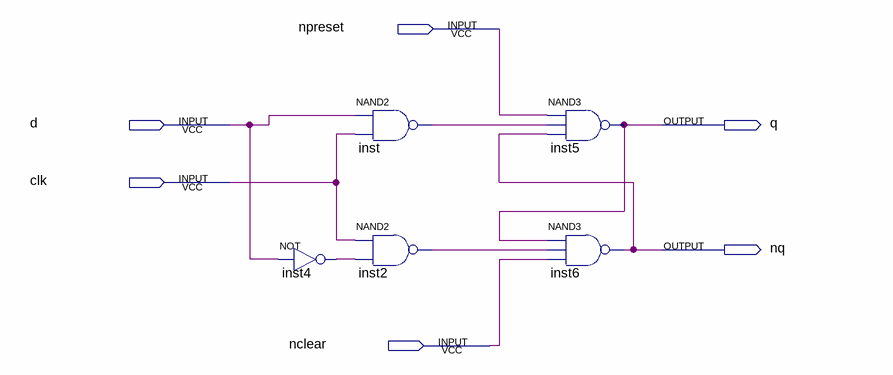
[diagram p0: schematic sheet]
// Quartus schematic latchd.bdf as structural Verilog: 5 symbols, 6 pins
module latchd (
  input  npreset,
  input  d,
  input  clk,
  input  nclear,
  output q,
  output nq
);

  wire inst2_out, inst4_out, inst_out;

  not inst4 (inst4_out, d);
  nand inst (inst_out, d, clk);
  nand inst2 (inst2_out, clk, inst4_out);
  nand inst5 (q, npreset, inst_out, nq);
  nand inst6 (nq, q, inst2_out, nclear);
endmodule
